# Altium schematic sheet Smart_Home.SchDoc
size A; SheetNumber: 1; SheetTotal: 1
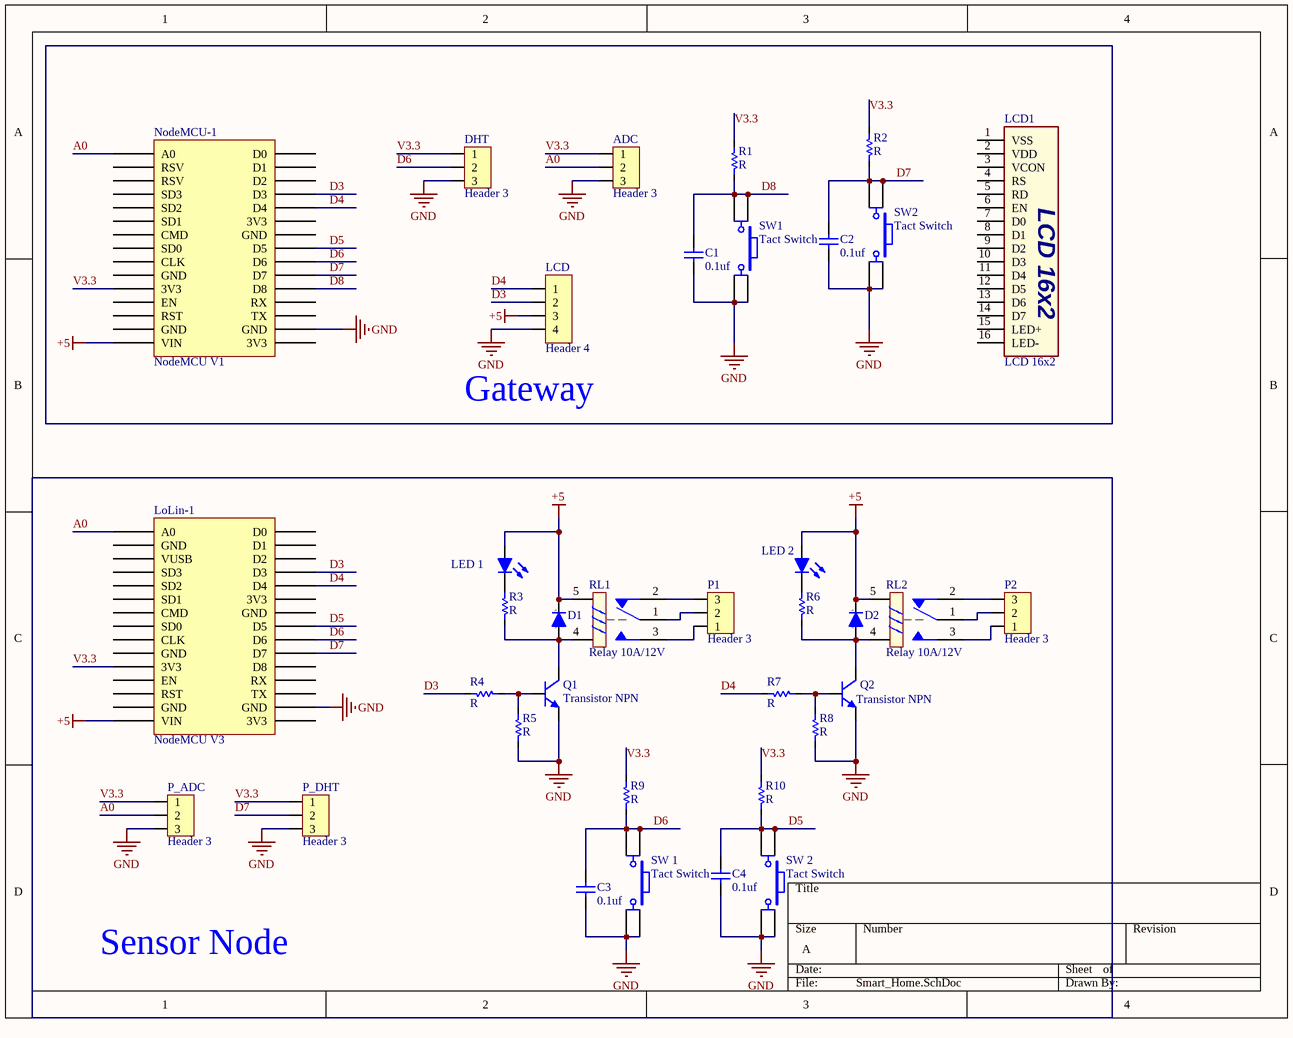
[diagram p0: Smart_Home.SchDoc]

## Parts
ADC  Header 3  [XH2.54-3P]
C1  0.1uf  [C 1206 (3216)]
C2  0.1uf  [C 1206 (3216)]
C3  0.1uf  [C 1206 (3216)]
C4  0.1uf  [C 1206 (3216)]
D1  Diode  [DO-214AC (SMA)]  (value not drawn)
D2  Diode  [DO-214AC (SMA)]  (value not drawn)
DHT  Header 3  [XH2.54-3P]
LCD  Header 4  [XH2.54-4P-RA]
LCD1  LCD 16x2  [LCD 16x2]
LED_1  Led  [LED 5MM]  (value not drawn)
LED_2  Led  [LED 5MM]  (value not drawn)
LoLin-1  NodeMCU V3  [LoLin NodeMcu V3]
NodeMCU-1  NodeMCU V1  [NodeMCU V1.0 ESP-12E]
P1  Header 3  [SH152-5.08-3P]
P2  Header 3  [SH152-5.08-3P]
P_ADC  Header 3  [XH2.54-3P]
P_DHT  Header 3  [XH2.54-3P]
Q1  Transistor NPN  [SOT-23]
Q2  Transistor NPN  [SOT-23]
R1  R  [R 1206 (3216)]
R2  R  [R 1206 (3216)]
R3  R  [R 1206 (3216)]
R4  R  [R 1206 (3216)]
R5  R  [R 1206 (3216)]
R6  R  [R 1206 (3216)]
R7  R  [R 1206 (3216)]
R8  R  [R 1206 (3216)]
R9  R  [R 1206 (3216)]
R10  R  [R 1206 (3216)]
RL1  Relay 10A/12V  [RL_SPDT_10A]
RL2  Relay 10A/12V  [RL_SPDT_10A]
SW1  Tact Switch  [SW/4/DIP/SMALL]
SW2  Tact Switch  [SW/4/DIP/SMALL]
SW_1  Tact Switch  [SW/4/DIP/SMALL]
SW_2  Tact Switch  [SW/4/DIP/SMALL]

## Nets
+5: D1.1(Cathode) D2.1(Cathode) LCD.3 LED_1.2(A) LED_2.2(A) LoLin-1.VIN NodeMCU-1.VIN RL1.5 RL2.5
GND: ADC.3 C1.2 C2.2 C3.2 C4.2 DHT.3 LCD.4 LoLin-1.GND NodeMCU-1.GND P_ADC.3 P_DHT.3 Q1.2(E) Q2.2(E) R5.2 R8.2 SW1.2 SW1.3 SW2.2 SW2.3 SW_1.2 SW_1.3 SW_2.2 SW_2.3
A0: ADC.2 LoLin-1.A0 NodeMCU-1.A0 P_ADC.2
D3: LCD.2 LoLin-1.D3 NodeMCU-1.D3 R4.1
D4: LCD.1 LoLin-1.D4 NodeMCU-1.D4 R7.1
D5: C4.1 LoLin-1.D5 NodeMCU-1.D5 R10.2 SW_2.1 SW_2.4
D6: C3.1 DHT.2 LoLin-1.D6 NodeMCU-1.D6 R9.2 SW_1.1 SW_1.4
D7: C2.1 LoLin-1.D7 NodeMCU-1.D7 P_DHT.2 R2.2 SW2.1 SW2.4
D8: C1.1 NodeMCU-1.D8 R1.2 SW1.1 SW1.4
V3.3: ADC.1 DHT.1 LoLin-1.3V3 NodeMCU-1.3V3 P_ADC.1 P_DHT.1 R1.1 R2.1 R9.1 R10.1
NetD1_2: D1.2(Anode) Q1.3(C) R3.2 RL1.4
NetD2_2: D2.2(Anode) Q2.3(C) R6.2 RL2.4
NetLED_1_1: LED_1.1(K) R3.1
NetLED_2_1: LED_2.1(K) R6.1
NetP1_1: P1.1 RL1.3
NetP1_2: P1.2 RL1.1
NetP1_3: P1.3 RL1.2
NetP2_1: P2.1 RL2.3
NetP2_2: P2.2 RL2.1
NetP2_3: P2.3 RL2.2
NetQ1_1: Q1.1(B) R4.2 R5.1
NetQ2_1: Q2.1(B) R7.2 R8.1

Not connected (* = marked no-connect by the designer): LCD1 1(VSS) 2(VDD) 3(VCON) 4(RS) 5(RD) 6(EN) 7(D0) 8(D1) 9(D2) 10(D3) 11(D4) 12(D5) 13(D6) 14(D7) 15(LED+) 16(LED-); LoLin-1 CLK CMD D0 D1 D2 D8 EN RST RX SD0 SD1 SD2 SD3 TX VUSB; NodeMCU-1 CLK CMD D0 D1 D2 EN RST RSV RX SD0 SD1 SD2 SD3 TX

## Notes on the sheet
- (near LCD) Gateway
- Sensor Node
- (in symbol Diode) k; a

## Library data of the parts
ADC DHT P1 P2 P_ADC P_DHT = Header 3: Header, 3-Pin
C1-C4 = Capacitor NP: Capacitor non-pol
D1 D2 = Diode: Default Diode; Published: 8-Jun-2000; LatestRevisionDate: 17-Jul-2002; LatestRevisionNote: Re-released for DXP Platform.; PackageVersion: Sep-1996; PackageReference: SMC; Publisher: Altium Limited; Code_JEDEC: DO-214-AB
LCD = Header 4: Header, 4-Pin
LCD1 = LCD 16x2: Character LCD 16x2
LED_1 LED_2 = Led: Typical LED
LoLin-1 = NodeMCU V1.0 ESP-12E_1: LoLin NodeMCU V3
NodeMCU-1 = NodeMCU V1.0 ESP-12E: NodeMCU V1.0 ESP8266 (ESP-12E)
Q1 Q2 = Transistor NPN: NPN Bipolar Transistor
R1-R10 = Resistor: Published: 8-Jun-2000; LatestRevisionDate: 17-Jul-2002; LatestRevisionNote: Re-released for DXP Platform.; PackageReference: AXIAL-0.3; Publisher: Altium Limited
RL1 RL2 = Relay 1: Relay SPDT,10A - 12VDC 5 Pin; Value: Relay SPDT, 10A, 12V
SW1 SW2 SW_1 SW_2 = SW SPST-4: Tact switch 4 pin